# EAGLE design casamatic (EAGLE 9.5.0)
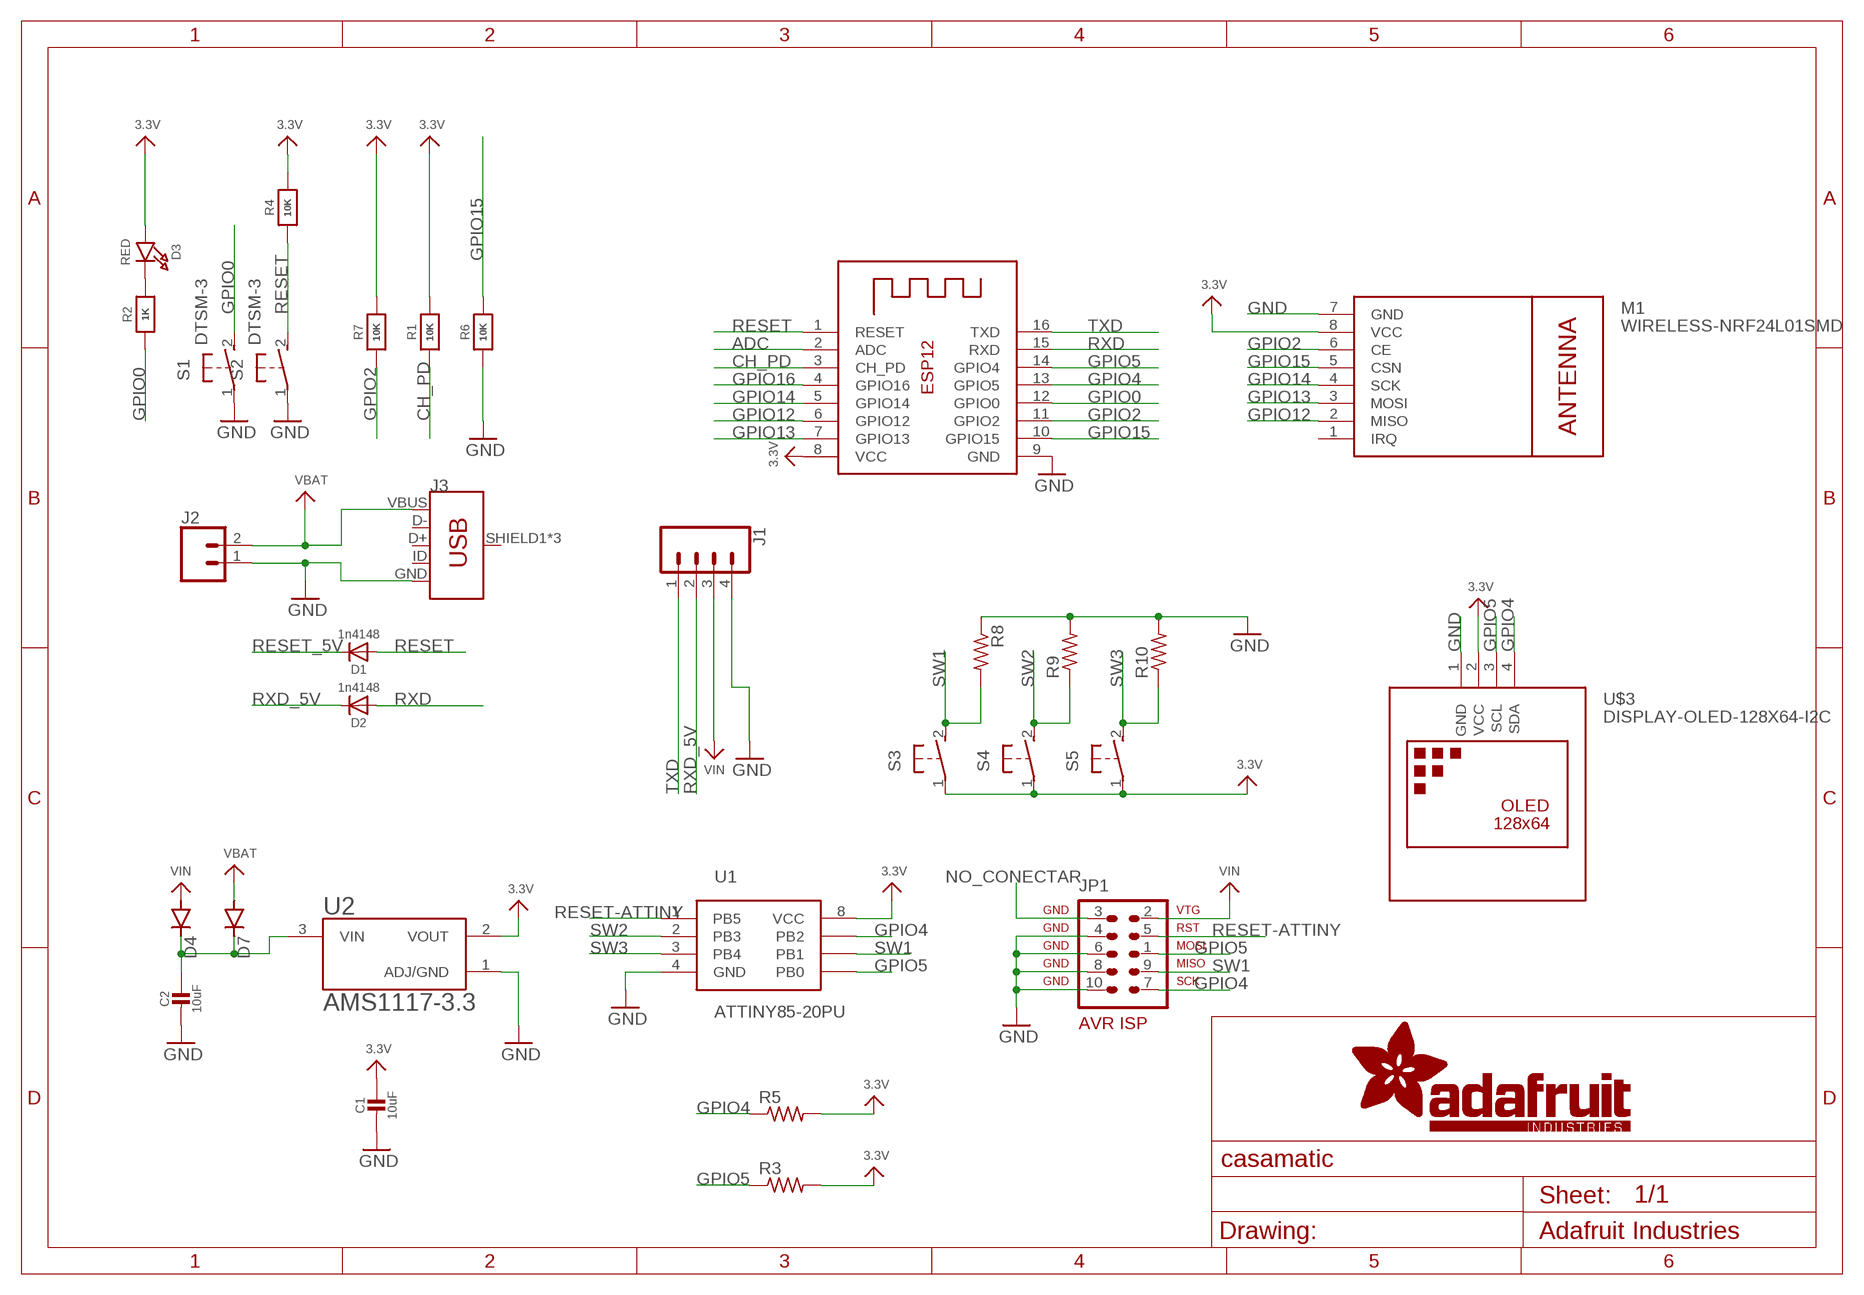
[diagram p0: schematic, sheet 1]

## Parts
C1  10uF  CAP_CERAMIC0603_NO  [0603-NO]
C2  10uF  CAP_CERAMIC0603_NO  [0603-NO]
D1  1n4148  DIODESOD-323  [SOD-323]
D2  1n4148  DIODESOD-323  [SOD-323]
D3  RED  LED0805_NOOUTLINE  [CHIPLED_0805_NOOUTLINE]
D4  DIODE-DO214AA  [DO214AA]
D7  DIODE-DO214AA  [DO214AA]
J1  CONN_04  [1X04]
J2  CONN_02  [1X02]
J3  USB_MICRO-B_FEMALE-SMT  [USB-B-MICRO-SMD]
JP1  AVR-ISP-10  [AVR-ISP-10]
M1  WIRELESS-NRF24L01SMD  [WIRELESS-NRF24L01-SMD]
R1  10K  RESISTOR0805_NOOUTLINE  [0805-NO]
R2  1K  RESISTOR0805_NOOUTLINE  [0805-NO]
R3  R-US_R0805  [R0805]
R4  10K  RESISTOR0805_NOOUTLINE  [0805-NO]
R5  R-US_R0805  [R0805]
R6  10K  RESISTOR0805_NOOUTLINE  [0805-NO]
R7  10K  RESISTOR0805_NOOUTLINE  [0805-NO]
R8  R-US_R0805  [R0805]
R9  R-US_R0805  [R0805]
R10  R-US_R0805  [R0805]
S1  DTSM-3  [DTSM-3]
S2  DTSM-3  [DTSM-3]
S3  DTSM-3  [DTSM-3]
S4  DTSM-3  [DTSM-3]
S5  DTSM-3  [DTSM-3]
U1  ATTINY85-20PU  [PDIP-8]
U2  AMS1117-3.3  [SOT229P700X180-4N]
U$3  DISPLAY-OLED-128X64-I2C  [DISPLAY-OLED-128X64-I2C]
X1  ESP-12  [ESP-12]

## Nets
3.3V: C1.1 D3.A M1.8(VCC) R1.2 R3.2 R4.2 R5.2 R7.2 S3.1 S4.1 S5.1 U1.8(VCC) U2.2(VOUT) U$3.2(VCC) X1.8(VCC)
ADC: X1.2(ADC)
CH_PD: R1.1 X1.3(CH_PD)
GND: C1.2 C2.2 J1.4 J2.1 J3.GND JP1.4 JP1.6 JP1.8 JP1.10 M1.7(GND) R6.1 R8.1 R9.2 R10.2 S1.1 S2.1 U1.4(GND) U2.1(ADJ/GND) U$3.1(GND) X1.9(GND)
GPIO0: R2.1 S1.2 X1.12(GPIO0)
GPIO2: M1.6(CE) R7.1 X1.11(GPIO2)
GPIO4: JP1.7 R5.1 U1.7(PB2) U$3.4(SDA) X1.13(GPIO5)
GPIO5: JP1.1 R3.1 U1.5(PB0) U$3.3(SCL) X1.14(GPIO4)
GPIO12: M1.2(MISO) X1.6(GPIO12)
GPIO13: M1.3(MOSI) X1.7(GPIO13)
GPIO14: M1.4(SCK) X1.5(GPIO14)
GPIO15: M1.5(CSN) R6.2 X1.10(GPIO15)
GPIO16: X1.4(GPIO16)
N$1: D3.C R2.2
N$2: C2.1 D4.C D7.C U2.3(VIN)
NO_CONECTAR: JP1.3
RESET: D1.A R4.1 S2.2 X1.1(RESET)
RESET-ATTINY: JP1.5 U1.1(PB5)
RESET_5V: D1.C
RXD: D2.A X1.15(RXD)
RXD_5V: D2.C J1.2
SW1: JP1.9 R8.2 S3.2 U1.6(PB1)
SW2: R9.1 S4.2 U1.2(PB3)
SW3: R10.1 S5.2 U1.3(PB4)
TXD: J1.1 X1.16(TXD)
VBAT: D7.A J2.2 J3.VBUS
VIN: D4.A J1.3 JP1.2
Unconnected: J3.D+ J3.D- J3.ID J3.SHIELD1(SHIELD) J3.SHIELD2(SHIELD) J3.SHIELD3(SHIELD) M1.1(IRQ)

## Library data of the parts
C1 C2 = microbuilder:CAP_CERAMIC: Ceramic Capacitors For new designs, use the packages preceded by an '_' character since they are more reliable: The following footprints should be used on most boards: _0402 - Standard footprint for regular board layouts _0603 - Standard footprint for regular board layouts _0805 - Standard footprint for regular board layouts _1206 - Standard footprint for regular board layouts For extremely tight-pitch boards where space is at a premium, the following 'micro-pitch' footprints can be used (smaller pads, no silkscreen outline, etc.): _0402MP - Micro-pitch footprint for very dense/compact boards _0603MP - Micro-pitch footprint for very dense/compact boards _0805MP - Micro-pitch footprint for very dense/compact boards _1206MP - Micro-pitch footprint for very dense/compact boards
D1 D2 = microbuilder:DIODE: Diode SMA Model Volts Amps Type Vf Ir Digikey # Notes SSA34-E3 40V 3A Schottky 480mV @ 3A 200uA @ 40V SSA34-E3/61TGITR-ND CDBA120-G 20V 1A Schottky 500mV @ 1A 500uA @ 20V 641-1014-6-ND REEL MBRA210 10V 2A Schottky 350mV @ 2A 700uA @ 10V MBRA210LT3 SOD-123 Model Volts Amps Type Vf Ir Order # Notes BAT54T1G 30V 200mA Schottky 800mV @ 200mA 2uA @ 25V BAT54T1GOSTR-ND B0530W 30V 500mA Schottky 430mV @ 500mA 130uA @ 30V B0530W-FDICT-ND REEL MBR120 20V 1A Schottky 340mV @ 1A MBR120VLSFT1GOSCT-ND SOD-323 Model Volts Amps Type Vf Ir Order # Notes PMEG2005EJ 20V 500mA Schottky 355mV @ 500mA 568-4110-1-ND ZLLS410 10V 570mA Schottky 380mV @ 570mA ZLLS410CT-ND 1N4148WS 75V 150mA Silicon/Simple 1V 1N4148WSFSCT-ND REEL SOD-523 Model Volts Amps Type Vf Ir Order # Notes BAT54XV2 30V 200mA Schottky 0.8V @ 100mA BAT54XV2CT-ND TB751S 30V 30mA Schottky RB751S-40TE61CT-ND SOT23-R/W (R = Solder Paste/Reflow Ovens, W = Hand-Soldering) Model Volts Amps Type Vf Ir Order # Notes BAT54FILM 40V 300mA Schottky 497-7162-1-ND POWERDI-5 Model Volts Amps Type Vf Ir Order # Notes PDS560 60V 5A Schottky 670mV @ 5A 150uA @ 60V PDS560DICT-ND
D3 = microbuilder:LED: LED 0603 - 0603 Surface Mount Package 2mA: Green LED - Low Power (3.9mcd, 2ma, 1.7Vf) - Digikey: 475-2709-2-ND Orange LED - Low Power (9.8mcd, 2ma, 1.8Vf) - Digikey: 475-1194-2-ND Red LED - Low Power (5mcd, 2ma, 1.8Vf) - Digikey: 475-1195-2-ND Yellow LED - Low Power (7mcd, 2ma, 1.8Vf) - Digikey: 475-1196-2-ND 5mA: Blue LED - Low Power (17mcd, 5ma, 2.9Vf) - Digikey: LNJ937W8CRACT-ND 0805 - 0805 Surface Mount Package 2mA: Red LED (8.8mcd, 2mA, 1.8Vf, Clear) - Low Power [Digikey: 475-2510-1-ND] Green LED (5mcd, 2mA, 1.8Vf, Clear) - Low Power [Digikey: 475-2730-1-ND] Yellow LED (11.3mcd, 2mA, 1.8Vf, Clear) - Low Power [Digikey: 475-2555-1-ND] 20mA: Red LED (104mcd, 20mA, Diffused) - LS R976 [Digikey: 475-1278-6-ND] Red LED (12mcd, 20mA, 2.0Vf, Clear) - APT2012EC [Digikey: 754-1128-1-ND] Green LED (15mcd, 20mA, 2.2Vf, Clear) - APT2012GC [Digikey: 754-1131-1-ND] Orange LED (160mcd, 20mA, 2.1Vf, Clear) - APT2012SECK [Digikey: 754-1130-1-ND] 1206 - 1206 Surface Mount Package Green LED (26mcd, 20mA, Diffused) - LG N971 [Digikey: 475-1407-6-ND] Red LED (15mcd, 20mA, Diffused) - LH N974 [Digikey: 475-1416-6-ND] Cree - Cree High-Power Surface Mount LEDs XPEBWT-L1-0000-00D50 - White 111lm 350mA 2.9Vf 6200K 110° XTEAWT-00-0000-00000LEE3 - White 114lm 350mA 2.85Vf 5000K 115° Everlight - Everlight 45-21 Series Surface Mount LEDs 45-21/QK2C-B2832AC2CB2/2T - Warm White 2000mcd 20mA 3.25Vf 3050K 120° 45-21/LK2C-B38452C4CB2/2T - Nuetral White 2000mcd 20mA 3.25Vf 4150K 120° 45-21/LK2C-B50634C6CB2/2T - Cold White 2200mcd 20mA 3.25Vf 5650K 120° PLCC2 Reverse Mount LS T77K-J1L2-1-0-2-R18-Z - Red 11.25mcd 2mA 1.8Vf 630nm 120° LO T77K-L1M2-24-Z - Orange 19.6mcd 2mA 1.8Vf 606nm 120° LY T77K-K2M1-26-Z - Yellow 15.7mcd 2mA 1.8Vf 587nm 120°
D4 D7 = diode:DIODE-: DIODE
J1 = SparkFun-Connectors:CONN_04: Multi connection point. Often used as Generic Header-pin footprint for 0.1 inch spaced/style header connections On any of the 0.1 inch spaced packages, you can populate with these: Break Away Headers - Straight <https://www.sparkfun.com/products/116> (PRT-00116) Break Away Male Headers - Right Angle <https://www.sparkfun.com/products/553> (PRT-00553) Female Headers <https://www.sparkfun.com/products/115> (PRT-00115) Break Away Headers - Machine Pin <https://www.sparkfun.com/products/117> (PRT-00117) Break Away Female Headers - Swiss Machine Pin <https://www.sparkfun.com/products/743> (PRT-00743) For SCREWTERMINALS and SPRING TERMINALS visit here: Screw Terimnals on SparkFun.com <https://www.sparkfun.com/search/results?term=Screw+Terminals> (5mm/3.5mm/2.54mm spacing) This device is also useful as a general connection point to wire up your design to another part of your project. Our various solder wires solder well into these plated through hole pads. Hook-Up Wire - Assortment (Stranded, 22 AWG) <https://www.sparkfun.com/products/11375> (PRT-11375) Hook-Up Wire - Assortment (Solid Core, 22 AWG) <https://www.sparkfun.com/products/11367> (PRT-11367) View the entire wire category on our website here <https://www.sparkfun.com/categories/141> Special notes: Molex polarized connector foot print use with SKU : PRT-08231 with associated crimp pins and housings. 1MM SMD Version SKU: PRT-10208; PROD_ID: CONN-09696
J2 = SparkFun-Connectors:CONN_02: Multi connection point. Often used as Generic Header-pin footprint for 0.1 inch spaced/style header connections On any of the 0.1 inch spaced packages, you can populate with these: Break Away Headers - Straight <https://www.sparkfun.com/products/116> (PRT-00116) Break Away Male Headers - Right Angle <https://www.sparkfun.com/products/553> (PRT-00553) Female Headers <https://www.sparkfun.com/products/115> (PRT-00115) Break Away Headers - Machine Pin <https://www.sparkfun.com/products/117> (PRT-00117) Break Away Female Headers - Swiss Machine Pin <https://www.sparkfun.com/products/743> (PRT-00743) For SCREWTERMINALS and SPRING TERMINALS visit here: Screw Terimnals on SparkFun.com <https://www.sparkfun.com/search/results?term=Screw+Terminals> (5mm/3.5mm/2.54mm spacing) This device is also useful as a general connection point to wire up your design to another part of your project. Our various solder wires solder well into these plated through hole pads. Hook-Up Wire - Assortment (Stranded, 22 AWG) <https://www.sparkfun.com/products/11375> (PRT-11375) Hook-Up Wire - Assortment (Solid Core, 22 AWG) <https://www.sparkfun.com/products/11367> (PRT-11367) View the entire wire category on our website here <https://www.sparkfun.com/categories/141> Special notes: Molex polarized connector foot print use with: PRT-08233 with associated crimp pins and housings. 2.54_SCREWTERM for use with PRT-10571. 3.5mm Screw Terminal footprints for PRT-08084 5mm Screw Terminal footprints for use with PRT-08432
J3 = SparkFun-Connectors:USB_MICRO-B: USB Type Micro-B Connector Male/female and PTH/SMT variants SparkFun Products: SparkFun microB USB Breakout <https://www.sparkfun.com/products/12035> SparkFun USB microB Plug Breakout <https://www.sparkfun.com/products/10031> SparkFun ESP8266 Thing <https://www.sparkfun.com/products/13231>; PROD_ID: CONN-11752
JP1 = atmel:AVR-ISP-10: AVR ISP-10 Serial Programming Header
M1 = nrf24l01-smd:WIRELESS-NRF24L01: 2.4 GHz Wireless Module based on NRF24L01 chip
R1 R2 R4 R6 R7 = microbuilder:RESISTOR: Resistors For new designs, use the packages preceded by an '_' character since they are more reliable: The following footprints should be used on most boards: _0402 - Standard footprint for regular board layouts _0603 - Standard footprint for regular board layouts _0805 - Standard footprint for regular board layouts _1206 - Standard footprint for regular board layouts For extremely tight-pitch boards where space is at a premium, the following 'micro-pitch' footprints can be used (smaller pads, no silkscreen outline, etc.): _0402MP - Micro-pitch footprint for very dense/compact boards _0603MP - Micro-pitch footprint for very dense/compact boards _0805MP - Micro-pitch footprint for very dense/compact boards _1206MP - Micro-pitch footprint for very dense/compact boards
R3 R5 R8-R10 = rcl:R-US_: RESISTOR, American symbol; SPICEPREFIX: R
S1-S5 = switch-tact:DTSM-3
U1 = Microcontroller:ATTINY85-20PU: IC MCU 8BIT 8KB FLASH 8DIP Manufacturer's datasheet <http://ww1.microchip.com/downloads/en/DeviceDoc/Atmel-2586-AVR-8-bit-Microcontroller-ATtiny25-ATtiny45-ATtiny85_Datasheet-Summary.pdf>; CREATED_BY: PCBLayout.com; DIGI_KEY_PART_NUMBER: ATTINY85-20PU-ND; MANUFACTURER: Microchip Technology; MPN: ATTINY85-20PU; PACKAGE: 8-PDIP
U2 = AMS1117-3.3:AMS1117-3.3: Sot223/Pkg 1-Amp 3.3-Volt Low Drop Out Voltage Regulatator; AVAILABILITY: Unavailable; DESCRIPTION: Sot223/Pkg 1-Amp 3.3-Volt Low Drop Out Voltage Regulatator; MF: Advanced Monolithic Systems; MP: AMS1117-3.3; PACKAGE: None; PRICE: None
U$3 = diy-modules:DISPLAY-OLED-128X64-I2C: 128x64 Dot Matrix OLED Module based on SSD1306 chip Variant with I2C interface More details available here: http://www.instructables.com/id/Monochrome-096-i2c-OLED-display-with-arduino-SSD13/ SSD1306 datasheet: https://cdn-shop.adafruit.com/datasheets/SSD1306.pdf Click here to find device on ebay.com <http://www.ebay.com/sch/oled+display+128x64+iic> Note: There are two variants: I2C and SPI. Search for the proper version.
X1 = microbuilder:ESP-12

## Board
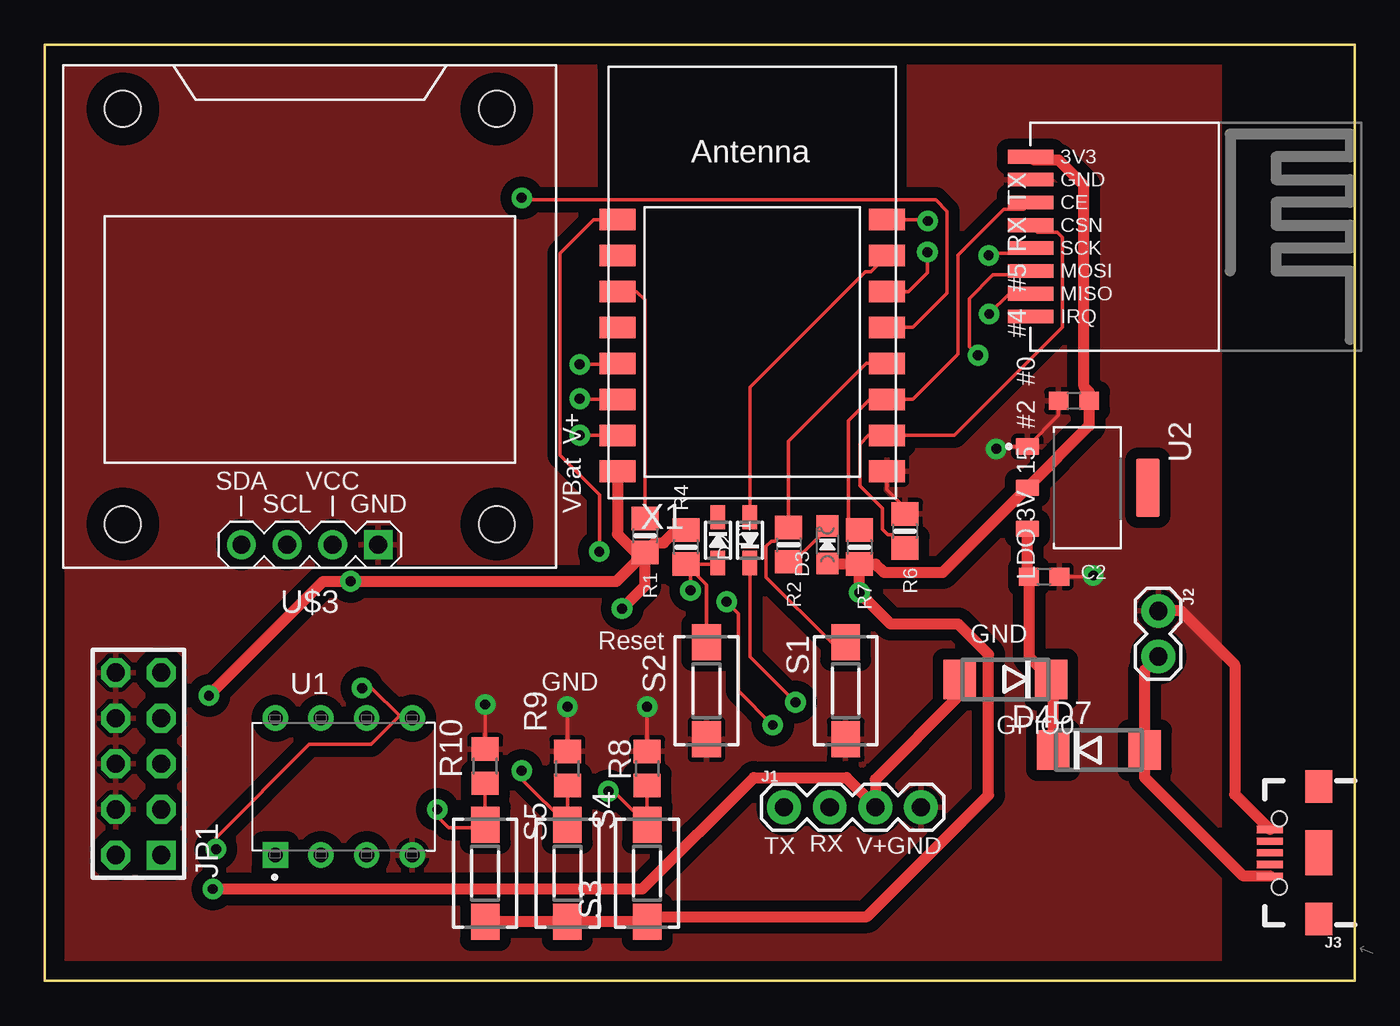
[diagram p1: board, top side]
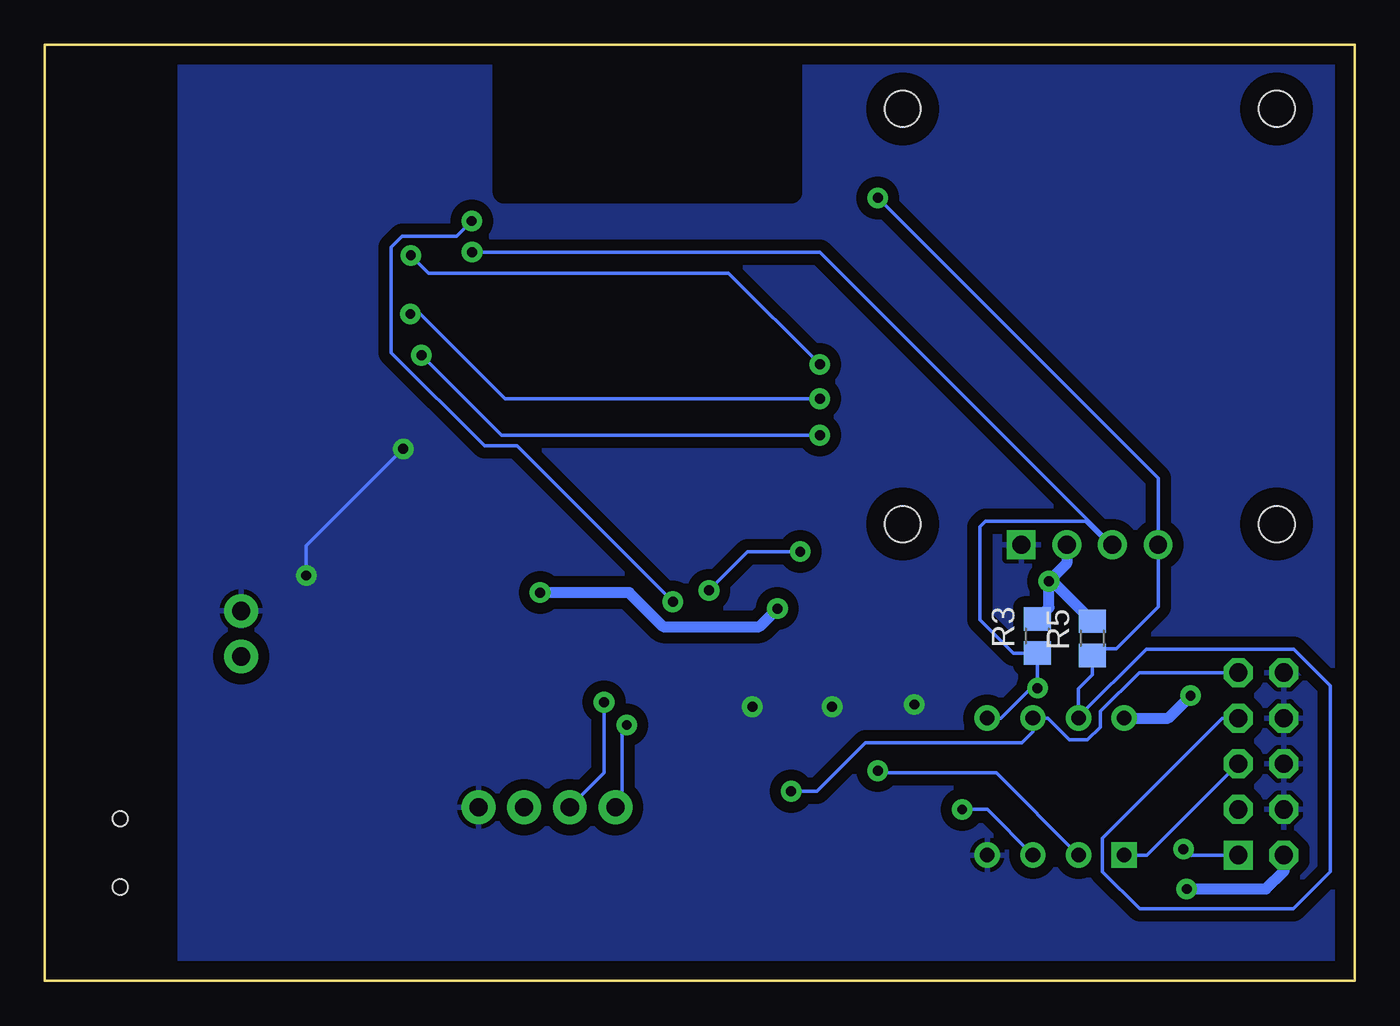
[diagram p2: board, bottom side, seen from below]

Size 72.91 x 52.07 mm. Coordinates in mm from the lower left corner, seen from the top.
Outline: 0,52.07 72.91,52.07 72.91,0 0,0 0,52.07
Copper layers (1*16): Top 0.035mm / dielectric 1.5mm / Bottom 0.035mm
Design rules "kraken-labs-rev5-post-casamatic": minimum track width 0.2mm, minimum drill 0.55mm, track to track 0.4mm, track to pad 0.4mm, pad to pad 0.4mm, via to via 0.4mm, smd to smd 0.2mm, copper to edge 40mil, drill to drill 6mil, minimum pad ring 0.3mm, minimum via ring 0.3mm, stop-mask expansion 4mil, vias tented up to drill 0mil, thermal gap 10mil

### Footprints (pad centres in the part's own frame; a part is rotated, then mirrored left to right if it is on the bottom)
0603-NO = smd 1.1 x 1: 1 -0.85,0; 2 0.85,0
SOD-323 = smd 1.35 x 0.8: A 1.27,0; C -1.27,0
CHIPLED_0805_NOOUTLINE = smd 1.2 x 1.2: A 0,-1.05; C 0,1.05
DO214AA = smd 1.8 x 2.2: A 2.55,0; C -2.55,0
1X04 = drill 1.016 pad 1.88: 1 0,0; 2 2.54,0; 3 5.08,0; 4 7.62,0
1X02 = drill 1.016 pad 1.88: 1 0,0; 2 2.54,0
USB-B-MICRO-SMD = smd 1.45 x 0.4: D+ 2.725,0; D- 2.725,0.65; GND 2.725,-1.3; ID 2.725,-0.65; VBUS 2.725,1.3 | smd 1.5 x 1.8: SHIELD1 0,3.685; SHIELD2 0,-3.685 | smd 1.5 x 2.5: SHIELD3 0,0 | hole 0.85: 2.2,1.9; 2.2,-1.9
AVR-ISP-10 = drill 1.016 square: 1 -5.08,-1.27 | drill 1.016 octagon: 2 -5.08,1.27; 3 -2.54,-1.27; 4 -2.54,1.27; 5 0,-1.27; 6 0,1.27; 7 2.54,-1.27; 8 2.54,1.27; 9 5.08,-1.27; 10 5.08,1.27
WIRELESS-NRF24L01-SMD = smd 2.54 x 0.762: 1 1.27,0; 2 1.27,1.27; 3 1.27,2.54; 4 1.27,3.81; 5 1.27,5.08; 6 1.27,6.35; 7 1.27,7.62; 8 1.27,8.89
0805-NO = smd 1.3 x 1.5: 1 -0.95,0; 2 0.95,0
R0805 = smd 1.3 x 1.5: 1 -0.95,0; 2 0.95,0
DTSM-3 = smd 2 x 1.6: 1 -2.7,0; 2 2.7,0
PDIP-8 = drill 0.813 pad 1.219 square: 1 -3.81,-3.81 | drill 0.813 pad 1.219: 2 -1.27,-3.81; 3 1.27,-3.81; 4 3.81,-3.81; 5 3.81,3.81; 6 1.27,3.81; 7 -1.27,3.81; 8 -3.81,3.81
SOT229P700X180-4N = smd 0.93 x 1.31: 1 -2.29,-3.345; 2 0,-3.345; 3 2.29,-3.345 | smd 3.24 x 1.31: 4 0,3.345
DISPLAY-OLED-128X64-I2C = drill 1 square: 1 -3.81,12.7 | drill 1: 2 -1.27,12.7; 3 1.27,12.7; 4 3.81,12.7 | hole 2: -10.414,11.557; 10.414,11.557; 10.414,-11.557; -10.414,-11.557
ESP-12 = smd 2 x 1.2: 1 -7.5,4.5; 2 -7.5,2.5; 3 -7.5,0.5; 4 -7.5,-1.5; 5 -7.5,-3.5; 6 -7.5,-5.5; 7 -7.5,-7.5; 8 -7.5,-9.5; 9 7.5,-9.5; 10 7.5,-7.5; 11 7.5,-5.5; 12 7.5,-3.5; 13 7.5,-1.5; 14 7.5,0.5; 15 7.5,2.5; 16 7.5,4.5

### Placement (x,y rotation side)
C1  57.28,32.26 180 top
C2  55.63,22.48 0 top
D1  37.47,24.51 270 top
D2  39.24,24.51 90 top
D3  43.56,24.26 0 top
D4  53.47,16.76 180 top
D7  58.67,12.83 0 top
J1  41.15,9.65 0 top
J2  61.98,20.57 270 top
J3  70.92,7.11 180 top
JP1  5.21,12.06 90 top
M1  53.6,36.96 0 top
R1  33.4,24.77 270 top
R2  41.4,24.26 270 top
R3  17.65,19.18 90 bottom
R4  35.69,24.13 90 top
R5  14.61,19.05 90 bottom
R6  47.88,25.02 270 top
R7  45.34,24.13 270 top
R8  33.53,11.81 270 top
R9  29.08,11.81 90 top
R10  24.51,11.94 90 top
S1  44.58,16.13 90 top
S2  36.83,16.13 90 top
S3  33.53,5.97 90 top
S4  29.08,5.97 90 top
S5  24.51,5.97 90 top
U1  16.64,10.79 0 top
U2  58.04,27.43 270 top
U$3  14.75,36.96 180 top
X1  39.37,37.85 0 top

### Tracks (layer width: path | path; a pad name or v marks a point on that pad's centre or on a via)
3.3V  (via drill 0.55)
  Top 0.61: X1.8 31.87,24.85 32.9,23.81 R1.2 | D3.A 45.31,23.21 R7.2 | R7.2 46.24,23.18 46.71,22.71 49.98,22.71 U2.2 58.13,30.86 C1.1 58.13,32.76 57.85,33.04 57.85,44.25 56.43,45.66 55.06,45.66 M1.8 | R1.2 31.81,22.23 v17.02,22.23 15.49,22.23 v9.13,15.86 | v32.13,20.7 33.4,21.97 R1.2 | R7.2 v45.34,21.59 47.09,19.84 50.84,19.84 52.52,18.16 52.52,10.32 45.77,3.56 33.82,3.56 S3.1 S4.1 S5.1 | R1.2 33.95,24.36 34.44,24.36 35.16,25.08 R4.2
  Bottom 0.61: v17.02,22.23 16.02,23.23 U$3.2 | v32.13,20.7 33.13,19.7 38.49,19.7 40.38,21.59 v45.34,21.59 | R5.2 16.83,22.23 v17.02,22.23 | R3.2 17.02,20.76 v17.02,22.23 | U1.8 10.38,14.6 v9.13,15.86
CH_PD
  Top 0.2: R1.1 33.4,37.88 32.94,38.35 X1.3
GND  (via drill 0.55)
  Top 0.2: R6.1 47.88,26.32 46.87,27.33 X1.9 | C1.2 56.43,31.45 U2.1 53.09,29.72 v52.96,29.59 | v58.36,22.54 58.29,22.48 C2.2 | R10.2 v24.51,15.37 | R9.2 v29.08,15.24 | R8.1 v33.53,15.24
  Top 0.61: J3.GND 66.24,10.37 66.24,17.58 63.25,20.57 J2.1
  Bottom 0.2: v52.96,29.59 58.36,24.19 v58.36,22.54
  pour Top (isolate 0.61): 0.25,0.25 0.25,51.82 65.38,51.82 65.38,0.25
  pour Bottom (isolate 0.61): 0.25,0.25 0.25,52.07 65.38,52.07 65.38,0.25
GPIO0
  Top 0.2: S1.2 43.77,18.83 40.15,22.45 40.15,24.16 40.45,24.46 40.65,24.46 R2.1 41.4,30.02 45.73,34.35 X1.12
GPIO2
  Top 0.2: M1.6 54.48,42.92 53.4,42.92 50.83,40.36 50.83,34.86 48.32,32.35 X1.11 45.93,32.35 44.73,31.15 44.73,25.68 R7.1
GPIO4  (via drill 0.55)
  Top 0.2: v26.54,43.56 26.66,43.45 49.6,43.45 50.22,42.82 50.22,38.25 48.32,36.35 X1.13
  Bottom 0.2: v26.54,43.56 10.94,27.96 U$3.4 10.94,20.8 13.27,18.47 14.04,18.47 14.61,17.91 | 14.61,17.91 14.61,17.02 15.37,16.26 U1.7 15.37,14.68 11.6,18.45 3.4,18.45 1.36,16.42 1.36,6.06 3.42,4 11.96,4 14.03,6.07 14.03,7.94 7.37,14.6 JP1.7 | 14.61,17.91 R5.1
GPIO5  (via drill 0.55)
  Top 0.2: v49.12,40.54 49.12,39.4 48.07,38.35 X1.14 | v9.53,7.32 9.53,7.96 14.71,13.14 18.15,13.14 19.74,14.74 18.2,16.28 v17.65,16.28
  Bottom 0.2: v49.12,40.54 29.76,40.54 U$3.3 13.68,24.26 14.98,25.56 20.57,25.56 20.86,25.26 20.86,20.08 19,18.23 R3.1 v17.65,16.28 18.01,16.28 19.69,14.6 U1.5 | JP1.1 9.19,6.98 v9.53,7.32
GPIO12  (via drill 0.55)
  Top 0.2: v52.56,37.1 53.69,38.23 M1.2 | X1.6 29.81,32.35 v29.77,32.38
  Bottom 0.2: v52.56,37.1 52.01,37.1 47.3,32.38 v29.77,32.38
GPIO13  (via drill 0.55)
  Top 0.2: v51.94,34.8 51.46,35.28 51.46,37.96 52.78,39.28 54.65,39.28 M1.3 | X1.7 v29.78,30.35 v29.77,30.35
  Bottom 0.2: v29.77,30.35 47.5,30.35 v51.94,34.8
GPIO14  (via drill 0.55)
  Top 0.2: M1.4 54.59,40.48 52.65,40.48 v52.53,40.36 | X1.5 31.81,34.29 v29.77,34.29
  Bottom 0.2: v29.77,34.29 34.85,39.37 51.55,39.37 v52.53,40.36
GPIO15
  Top 0.2: M1.5 55.26,41.65 56.35,41.65 56.64,41.36 56.64,36.37 50.62,30.35 X1.10 45.85,30.35 45.37,29.86 45.37,27.54 46.63,26.28 46.63,25.11 46.92,24.82 47.13,24.82 R6.2
N$1
  Top 0.2: R2.2 41.69,23.31 43.56,25.18 D3.C
N$2
  Top 0.61: U2.3 54.69,22.56 C2.1 54.78,18.03 56.02,16.79 D4.C 56.12,16.66 D7.C
RESET  (via drill 0.55)
  Top 0.2: R4.1 36.83,22.04 S2.2 | R4.1 37.4,23.18 D1.A | X1.1 30.55,42.35 28.67,40.47 28.67,29.24 30.86,27.05 v30.86,23.88 | v35.94,21.72 35.94,22.93 R4.1
  Bottom 0.2: v35.94,21.72 33.78,23.88 v30.86,23.88
RESET-ATTINY
  Bottom 0.2: JP1.5 11.56,6.98 U1.1
RXD
  Top 0.2: X1.15 45.97,39.45 45.66,39.45 39.24,33.03 D2.A
RXD_5V  (via drill 0.55)
  Top 0.2: D2.C 39.24,18.03 v41.78,15.49
  Bottom 0.2: v41.78,15.49 41.78,11.56 J1.2
SW1  (via drill 0.55)
  Top 0.2: v31.37,10.54 31.66,10.54 S3.2 R8.2
  Bottom 0.2: v31.37,10.54 29.93,10.54 27.23,13.24 18.51,13.24 17.91,13.84 U1.6 17.07,14.6 15.87,13.4 14.87,13.4 14.16,14.1 14.16,14.98 11.99,17.14 JP1.9
SW2  (via drill 0.55)
  Top 0.2: v26.54,11.68 26.54,11.21 S4.2 R9.1
  Bottom 0.2: U1.2 19.94,11.56 26.42,11.56 v26.54,11.68
SW3  (via drill 0.55)
  Top 0.2: v21.84,9.52 21.84,9.14 22.48,8.51 24.35,8.51 S5.2 R10.1
  Bottom 0.2: U1.3 20.45,9.52 v21.84,9.52
TXD  (via drill 0.55)
  Top 0.2: X1.16 49.07,42.35 v49.15,42.27 | v37.95,21.08 38.61,20.42 38.61,16.13 v40.51,14.22
  Bottom 0.2: v37.95,21.08 46.62,29.75 48.44,29.75 53.64,34.95 53.64,40.82 53.02,41.44 49.98,41.44 v49.15,42.27 | v40.51,14.22 40.77,13.97 40.77,10.03 J1.1
VBAT
  Top 0.61: J3.VBUS 66.72,5.81 61.22,11.3 D7.A 61.22,17.28 J2.2
VIN  (via drill 0.55)
  Top 0.61: D4.A 50.92,15.88 46.23,11.19 J1.3 46.23,9.69 44.62,11.3 39.46,11.3 33.27,5.1 v9.35,5.1
  Bottom 0.61: JP1.2 3.94,6.1 4.93,5.1 v9.35,5.1

### Text on the board
tPlace: TX | RX | #5 | #4 | #0 | #2 | V+ | 15 | VBat | 3V | LDO | GND | Reset | GND | GPIO0 | TX | RX | V+ | GND